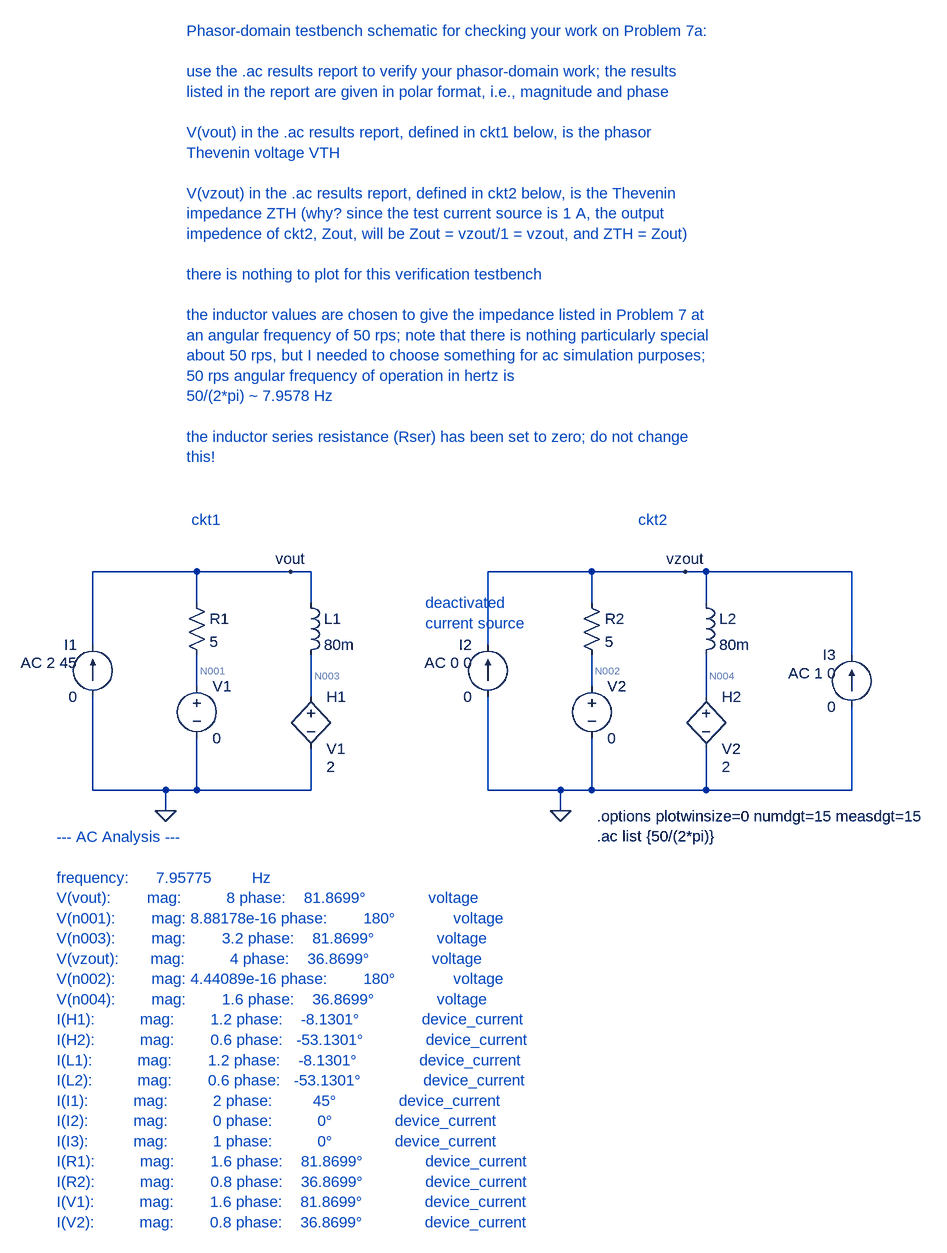
[diagram p0: schematic hw7_prob7a.asc]
hw7_prob7a.asc, the LTspice schematic file:
Version 4
SHEET 1 1040 796
WIRE -512 -160 -672 -160
WIRE -368 -160 -512 -160
WIRE -336 -160 -368 -160
WIRE 96 -160 -64 -160
WIRE 240 -160 96 -160
WIRE 272 -160 240 -160
WIRE 496 -160 272 -160
WIRE -512 -112 -512 -160
WIRE -336 -112 -336 -160
WIRE 96 -112 96 -160
WIRE 272 -112 272 -160
WIRE -672 -48 -672 -160
WIRE -64 -48 -64 -160
WIRE 496 -32 496 -160
WIRE -512 16 -512 -32
WIRE 96 16 96 -32
WIRE -336 32 -336 -32
WIRE 272 32 272 -32
WIRE -672 176 -672 32
WIRE -560 176 -672 176
WIRE -512 176 -512 96
WIRE -512 176 -560 176
WIRE -336 176 -336 112
WIRE -336 176 -512 176
WIRE -64 176 -64 32
WIRE 48 176 -64 176
WIRE 96 176 96 96
WIRE 96 176 48 176
WIRE 272 176 272 112
WIRE 272 176 96 176
WIRE 496 176 496 48
WIRE 496 176 272 176
WIRE -560 208 -560 176
WIRE 48 208 48 176
FLAG -560 208 0
FLAG -368 -160 vout
FLAG 48 208 0
FLAG 240 -160 vzout
SYMBOL res -528 -128 R0
SYMATTR InstName R1
SYMATTR Value 5
SYMBOL ind -352 -128 R0
SYMATTR InstName L1
SYMATTR Value 80m
SYMATTR SpiceLine Rser=0
SYMBOL current -672 32 R180
WINDOW 0 24 80 Left 2
WINDOW 3 24 0 Left 2
WINDOW 123 24 52 Left 2
SYMATTR InstName I1
SYMATTR Value 0
SYMATTR Value2 AC 2 45
SYMBOL h -336 16 R0
WINDOW 123 24 124 Left 2
SYMATTR Value2 2
SYMATTR InstName H1
SYMATTR Value V1
SYMBOL voltage -512 0 R0
WINDOW 123 0 0 Left 0
WINDOW 39 0 0 Left 0
SYMATTR InstName V1
SYMATTR Value 0
SYMBOL res 80 -128 R0
SYMATTR InstName R2
SYMATTR Value 5
SYMBOL ind 256 -128 R0
SYMATTR InstName L2
SYMATTR Value 80m
SYMATTR SpiceLine Rser=0
SYMBOL current -64 32 R180
WINDOW 0 24 80 Left 2
WINDOW 3 24 0 Left 2
WINDOW 123 24 52 Left 2
SYMATTR InstName I2
SYMATTR Value 0
SYMATTR Value2 AC 0 0
SYMBOL h 272 16 R0
WINDOW 123 24 124 Left 2
SYMATTR Value2 2
SYMATTR InstName H2
SYMATTR Value V2
SYMBOL voltage 96 0 R0
WINDOW 123 0 0 Left 0
WINDOW 39 0 0 Left 0
SYMATTR InstName V2
SYMATTR Value 0
SYMBOL current 496 48 R180
WINDOW 0 24 80 Left 2
WINDOW 3 24 0 Left 2
WINDOW 123 24 52 Left 2
SYMATTR InstName I3
SYMATTR Value 0
SYMATTR Value2 AC 1 0
TEXT -520 -240 Left 2 ;ckt1
TEXT 168 -240 Left 2 ;ckt2
TEXT -160 -112 Left 2 ;deactivated\ncurrent source
TEXT 104 216 Left 2 !.options plotwinsize=0 numdgt=15 measdgt=15\n.ac list {50/(2*pi)}
TEXT -528 -992 Left 2 ;Phasor-domain testbench schematic for checking your work on Problem 7a:\n \nuse the .ac results report to verify your phasor-domain work; the results\nlisted in the report are given in polar format, i.e., magnitude and phase\n \nV(vout) in the .ac results report, defined in ckt1 below, is the phasor \nThevenin voltage VTH\n \nV(vzout) in the .ac results report, defined in ckt2 below, is the Thevenin \nimpedance ZTH (why? since the test current source is 1 A, the output \nimpedence of ckt2, Zout, will be Zout = vzout/1 = vzout, and ZTH = Zout)\n \nthere is nothing to plot for this verification testbench\n \nthe inductor values are chosen to give the impedance listed in Problem 7 at \nan angular frequency of 50 rps; note that there is nothing particularly special \nabout 50 rps, but I needed to choose something for ac simulation purposes; \n50 rps angular frequency of operation in hertz is\n50/(2*pi) ~ 7.9578 Hz\n \nthe inductor series resistance (Rser) has been set to zero; do not change \nthis!
TEXT -728 248 Left 2 ;--- AC Analysis ---\n \nfrequency:      7.95775         Hz\nV(vout):        mag:          8 phase:    81.8699°              voltage\nV(n001):        mag: 8.88178e-16 phase:        180°             voltage\nV(n003):        mag:        3.2 phase:    81.8699°              voltage\nV(vzout):       mag:          4 phase:    36.8699°              voltage\nV(n002):        mag: 4.44089e-16 phase:        180°             voltage\nV(n004):        mag:        1.6 phase:    36.8699°              voltage\nI(H1):          mag:        1.2 phase:    -8.1301°              device_current\nI(H2):          mag:        0.6 phase:   -53.1301°              device_current\nI(L1):          mag:        1.2 phase:    -8.1301°              device_current\nI(L2):          mag:        0.6 phase:   -53.1301°              device_current\nI(I1):          mag:          2 phase:         45°              device_current\nI(I2):          mag:          0 phase:          0°              device_current\nI(I3):          mag:          1 phase:          0°              device_current\nI(R1):          mag:        1.6 phase:    81.8699°              device_current\nI(R2):          mag:        0.8 phase:    36.8699°              device_current\nI(V1):          mag:        1.6 phase:    81.8699°              device_current\nI(V2):          mag:        0.8 phase:    36.8699°              device_current

The netlist it stands for:
* hw7_prob7a.asc
R1 vout N001 5
L1 vout N003 80m Rser=0
I1 0 vout 0 AC 2 45
H1 N003 0 V1 2
V1 N001 0 0
R2 vzout N002 5
L2 vzout N004 80m Rser=0
I2 0 vzout 0 AC 0 0
H2 N004 0 V2 2
V2 N002 0 0
I3 0 vzout 0 AC 1 0
* ckt1
* ckt2
* deactivated
* current source
.options plotwinsize=0 numdgt=15 measdgt=15
.ac list {50/(2*pi)}
* Phasor-domain testbench schematic for checking your work on Problem 7a:
* use the .ac results report to verify your phasor-domain work; the results
* listed in the report are given in polar format, i.e., magnitude and phase
* V(vout) in the .ac results report, defined in ckt1 below, is the phasor
* Thevenin voltage VTH
* V(vzout) in the .ac results report, defined in ckt2 below, is the Thevenin
* impedance ZTH (why? since the test current source is 1 A, the output
* impedence of ckt2, Zout, will be Zout = vzout/1 = vzout, and ZTH = Zout)
* there is nothing to plot for this verification testbench
* the inductor values are chosen to give the impedance listed in Problem 7 at
* an angular frequency of 50 rps; note that there is nothing particularly special
* about 50 rps, but I needed to choose something for ac simulation purposes;
* 50 rps angular frequency of operation in hertz is
* 50/(2*pi) ~ 7.9578 Hz
* the inductor series resistance (Rser) has been set to zero; do not change
* this!
* --- AC Analysis ---
* frequency:      7.95775         Hz
* V(vout):        mag:          8 phase:    81.8699°              voltage
* V(n001):        mag: 8.88178e-16 phase:        180°             voltage
* V(n003):        mag:        3.2 phase:    81.8699°              voltage
* V(vzout):       mag:          4 phase:    36.8699°              voltage
* V(n002):        mag: 4.44089e-16 phase:        180°             voltage
* V(n004):        mag:        1.6 phase:    36.8699°              voltage
* I(H1):          mag:        1.2 phase:    -8.1301°              device_current
* I(H2):          mag:        0.6 phase:   -53.1301°              device_current
* I(L1):          mag:        1.2 phase:    -8.1301°              device_current
* I(L2):          mag:        0.6 phase:   -53.1301°              device_current
* I(I1):          mag:          2 phase:         45°              device_current
* I(I2):          mag:          0 phase:          0°              device_current
* I(I3):          mag:          1 phase:          0°              device_current
* I(R1):          mag:        1.6 phase:    81.8699°              device_current
* I(R2):          mag:        0.8 phase:    36.8699°              device_current
* I(V1):          mag:        1.6 phase:    81.8699°              device_current
* I(V2):          mag:        0.8 phase:    36.8699°              device_current
.backanno
.end

* Results of the author's LTspice run, read from the files saved beside the schematic
* AC Analysis:
*   frequency = 7.958 
*   V(vout) = 1.131 V
*   V(n001) = 0 V
*   V(n003) = 452.5 mV
*   V(vzout) = 3.2 V
*   V(n002) = 0 V
*   V(n004) = 1.28 V
*   I(H1) = 1.188 A
*   I(H2) = 360 mA
*   I(L1) = 1.188 A
*   I(L2) = 360 mA
*   I(I1) = 1.414 A
*   I(I2) = 0 A
*   I(I3) = 1 A
*   I(R1) = 226.3 mA
*   I(R2) = 640 mA
*   I(V1) = 226.3 mA
*   I(V2) = 640 mA